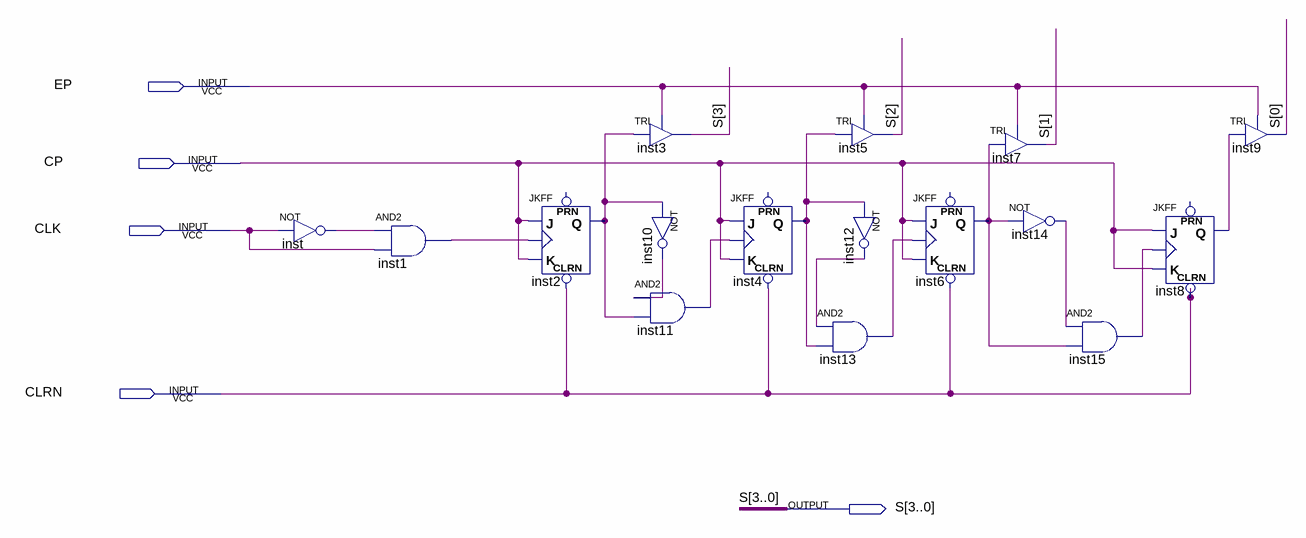
[diagram p0: schematic sheet]
// Quartus schematic Contador_Programa.bdf as structural Verilog: 16 symbols, 5 pins
module Contador_Programa (
  input  EP,
  input  CP,
  input  CLK,
  input  CLRN,
  output [3:0] S
);

  wire inst1_out, inst2_q, inst4_q, inst6_q, inst8_q, inst10_out, inst11_out, inst12_out, inst13_out,
       inst14_out, inst15_out, inst_out;

  not inst (inst_out, CLK);
  and inst1 (inst1_out, inst_out, CLK);
  JKFF inst2 (.CLRN(CLRN), .K(CP), .J(CP), .CLK(inst1_out), .Q(inst2_q));  // open: PRN
  TRI inst3 (.IN(inst2_q), .OE(EP), .OUT(S[3]));
  not inst10 (inst10_out, inst2_q);
  and inst11 (inst11_out, inst10_out, inst2_q);
  JKFF inst4 (.CLRN(CLRN), .K(CP), .J(CP), .CLK(inst11_out), .Q(inst4_q));  // open: PRN
  TRI inst5 (.IN(inst4_q), .OE(EP), .OUT(S[2]));
  not inst12 (inst12_out, inst4_q);
  and inst13 (inst13_out, inst12_out, inst4_q);
  JKFF inst6 (.CLRN(CLRN), .K(CP), .J(CP), .CLK(inst13_out), .Q(inst6_q));  // open: PRN
  TRI inst7 (.IN(inst6_q), .OE(EP), .OUT(S[1]));
  not inst14 (inst14_out, inst6_q);
  and inst15 (inst15_out, inst14_out, inst6_q);
  JKFF inst8 (.CLRN(CLRN), .K(CP), .J(CP), .CLK(inst15_out), .Q(inst8_q));  // open: PRN
  TRI inst9 (.IN(inst8_q), .OE(EP), .OUT(S[0]));
endmodule
